# Altium schematic sheet ESP32.SchDoc
size A4
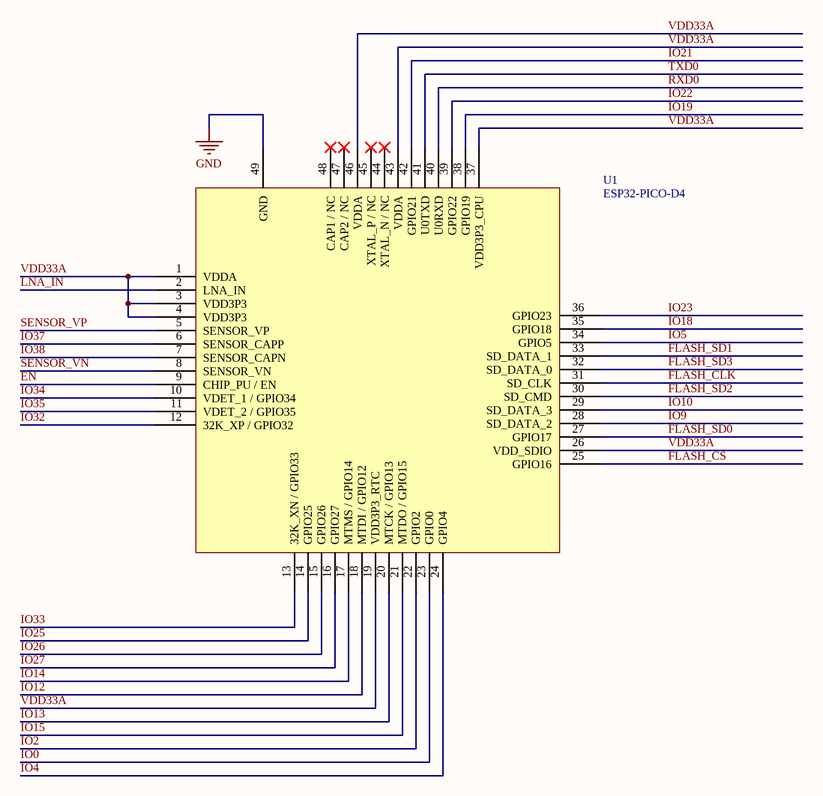
[diagram p0: ESP32.SchDoc]

## Parts
U1  ESP32-PICO-D4  [ESP32-PICO-D4]

## Nets
GND: U1.49(GND)
EN: U1.9(CHIP_PU_/_EN)
FLASH_CLK: U1.31(SD_CLK)
FLASH_CS: U1.25(GPIO16)
FLASH_SD0: U1.27(GPIO17)
FLASH_SD1: U1.33(SD_DATA_1)
FLASH_SD2: U1.30(SD_CMD)
FLASH_SD3: U1.32(SD_DATA_0)
IO0: U1.23(GPIO0)
IO2: U1.22(GPIO2)
IO4: U1.24(GPIO4)
IO5: U1.34(GPIO5)
IO9: U1.28(SD_DATA_2)
IO10: U1.29(SD_DATA_3)
IO12: U1.18(MTDI_/_GPIO12)
IO13: U1.20(MTCK_/_GPIO13)
IO14: U1.17(MTMS_/_GPIO14)
IO15: U1.21(MTDO_/_GPIO15)
IO18: U1.35(GPIO18)
IO19: U1.38(GPIO19)
IO21: U1.42(GPIO21)
IO22: U1.39(GPIO22)
IO23: U1.36(GPIO23)
IO25: U1.14(GPIO25)
IO26: U1.15(GPIO26)
IO27: U1.16(GPIO27)
IO32: U1.12(32K_XP_/_GPIO32)
IO33: U1.13(32K_XN_/_GPIO33)
IO34: U1.10(VDET_1_/_GPIO34)
IO35: U1.11(VDET_2_/_GPIO35)
IO37: U1.6(SENSOR_CAPP)
IO38: U1.7(SENSOR_CAPN)
LNA_IN: U1.2(LNA_IN)
RXD0: U1.40(U0RXD)
SENSOR_VN: U1.8(SENSOR_VN)
SENSOR_VP: U1.5(SENSOR_VP)
TXD0: U1.41(U0TXD)
VDD33A: U1.1(VDDA) U1.3(VDD3P3) U1.4(VDD3P3) U1.19(VDD3P3_RTC) U1.26(VDD_SDIO) U1.37(VDD3P3_CPU) U1.43(VDDA) U1.46(VDDA)

Not connected (* = marked no-connect by the designer): U1 44(XTAL_N_/_NC)* 45(XTAL_P_/_NC)* 47(CAP2_/_NC)* 48(CAP1_/_NC)*

## Library data of the parts
U1 = ESP32-PICO-D4: RF TRANSCEIVER ICS QFN-48_7X7X05P ROHS; Manufacturer: Espressif Systems; ComponentLink1Description: Datasheet; ComponentLink1URL: https://datasheet.lcsc.com/szlcsc/Espressif-Systems-ESP32-PICO-D4_C193707.pdf; ComponentLink2Description: Datasheet_EN; ComponentLink2URL: https://www.espressif.com/sites/default/files/documentation/esp32-pico-d4_datasheet_en.pdf; MFR.Part #: ESP32-PICO-D4; LCSC Part #: C193707; Package: QFN-48_EP_7.0x7.0x0.5P